# EAGLE schematic sb-mote2 (EAGLE 7.6.0)
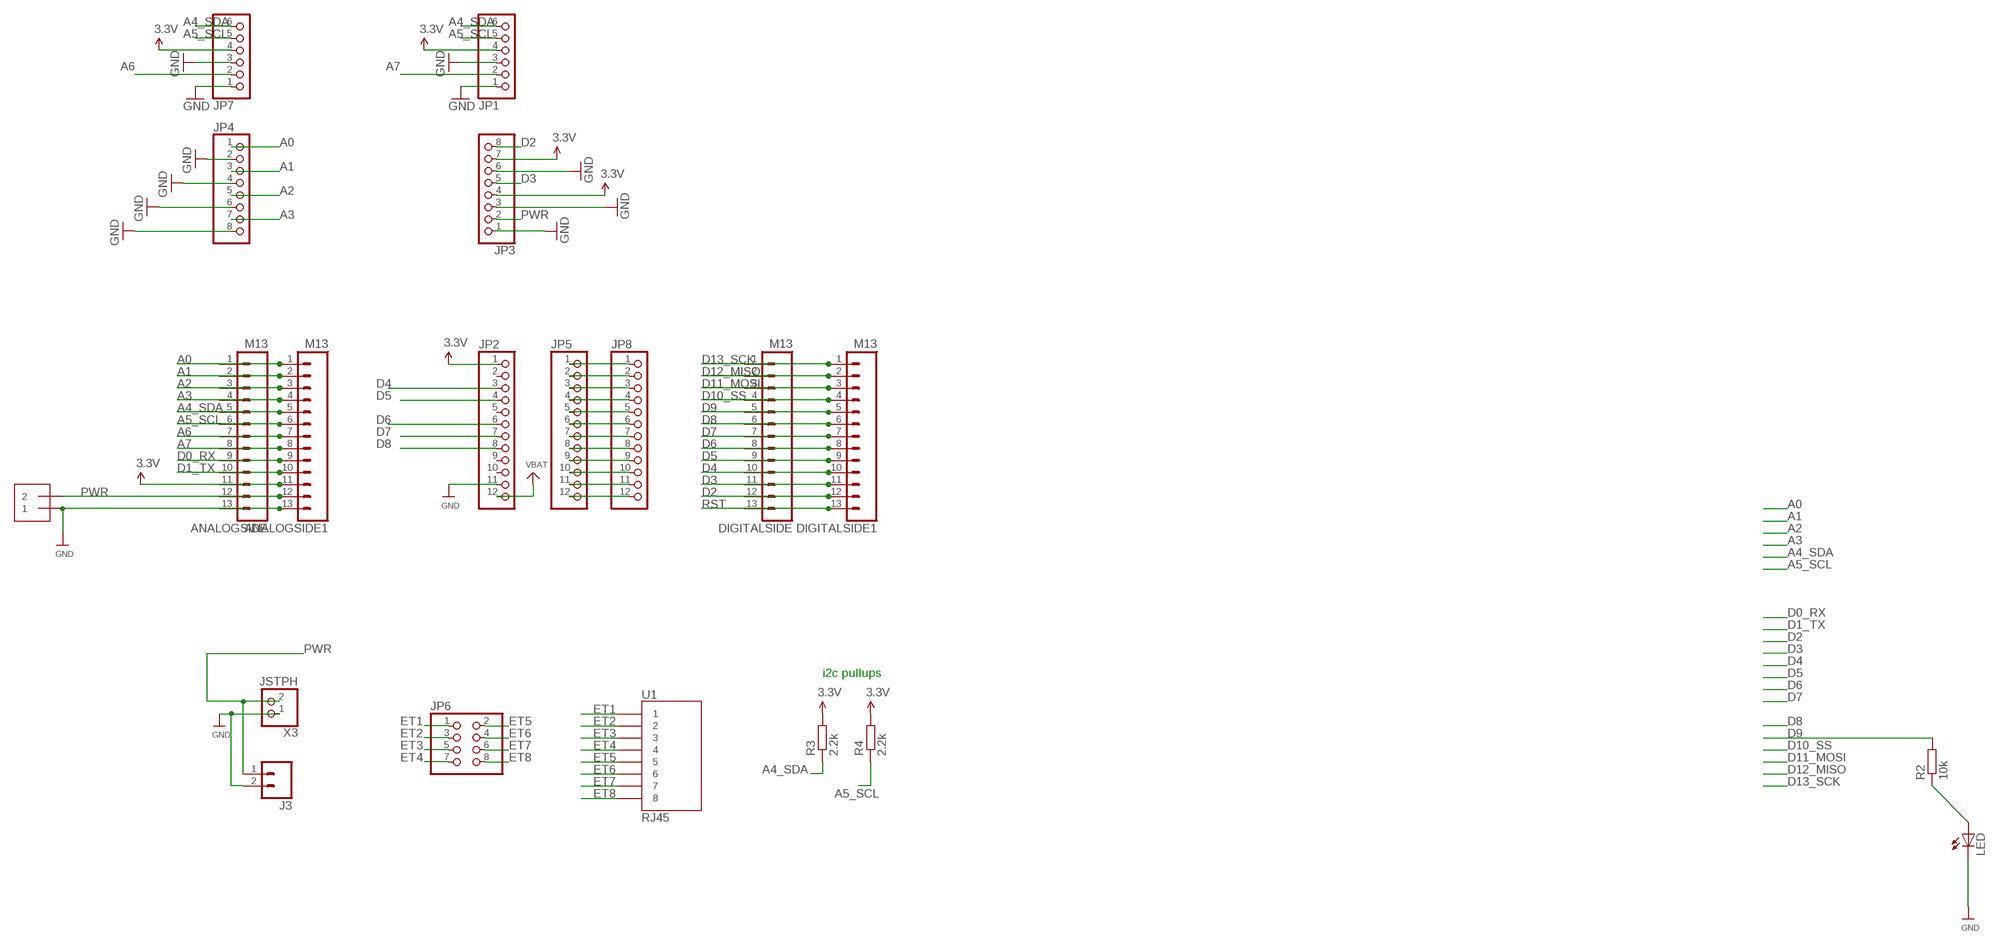
[diagram p0: schematic, sheet 1]

## Parts
ANALOGSIDE  M13  [1X13]
ANALOGSIDE1  M13  [1X13]
DIGITALSIDE  M13  [1X13]
DIGITALSIDE1  M13  [1X13]
J2  1X2-3.5MM  [1X2-3.5MM]
J3  M02PTH  [1X02]
JP1  PINHD-1X6-3.5MM  [1X06-3.5MM]
JP2  PINHD-1X12-CB  [1X12-CB]
JP3  PINHD-1X8-3.5MM  [1X08-3.5MM]
JP4  PINHD-1X8-3.5MM  [1X08-3.5MM]
JP5  PINHD-1X12-CB  [1X12-CB]
JP6  PINHD-2X4  [2X04]
JP7  PINHD-1X6-3.5MM  [1X06-3.5MM]
JP8  PINHD-1X12-CB  [1X12-CB]
LED  LED3MM  [LED3MM]
R2  10k  R-EU_0204/7  [0204/7]
R3  2.2k  R-EU_0204/7  [0204/7]
R4  2.2k  R-EU_0204/7  [0204/7]
U1  RJ45  RJ45-8PTH  [RJ45-8]
X3  JSTPH  CON_JST_PH_2PIN  [JSTPH2]

## Nets
A0: ANALOGSIDE1.1 ANALOGSIDE.1 JP4.1
A1: ANALOGSIDE1.2 ANALOGSIDE.2 JP4.3
A2: ANALOGSIDE1.3 ANALOGSIDE.3 JP4.5
A3: ANALOGSIDE1.4 ANALOGSIDE.4 JP4.7
A4_SDA: ANALOGSIDE1.5 ANALOGSIDE.5 JP1.6 JP7.6 R3.1
A5_SCL: ANALOGSIDE1.6 ANALOGSIDE.6 JP1.5 JP7.5 R4.1
A6: ANALOGSIDE1.7 ANALOGSIDE.7 JP7.2
A7: ANALOGSIDE1.8 ANALOGSIDE.8 JP1.2
D0_RX: ANALOGSIDE1.9 ANALOGSIDE.9
D1_TX: ANALOGSIDE1.10 ANALOGSIDE.10
D2: DIGITALSIDE1.12 DIGITALSIDE.12 JP3.8
D3: DIGITALSIDE1.11 DIGITALSIDE.11 JP3.5
D4: DIGITALSIDE1.10 DIGITALSIDE.10 JP2.3
D5: DIGITALSIDE1.9 DIGITALSIDE.9 JP2.4
D6: DIGITALSIDE1.8 DIGITALSIDE.8 JP2.6
D7: DIGITALSIDE1.7 DIGITALSIDE.7 JP2.7
D8: DIGITALSIDE1.6 DIGITALSIDE.6 JP2.8
D9: DIGITALSIDE1.5 DIGITALSIDE.5 R2.2
D10_SS: DIGITALSIDE1.4 DIGITALSIDE.4
D11_MOSI: DIGITALSIDE1.3 DIGITALSIDE.3
D12_MISO: DIGITALSIDE1.2 DIGITALSIDE.2
D13_SCK: DIGITALSIDE1.1 DIGITALSIDE.1
ET1: JP6.1 U1.1
ET2: JP6.3 U1.2
ET3: JP6.5 U1.3
ET4: JP6.7 U1.4
ET5: JP6.2 U1.5
ET6: JP6.4 U1.6
ET7: JP6.6 U1.7
ET8: JP6.8 U1.8
GND [power]: ANALOGSIDE1.13 ANALOGSIDE.13 J2.1 J3.2 JP1.1 JP1.3 JP2.11 JP3.1 JP3.3 JP3.6 JP4.2 JP4.4 JP4.6 JP4.8 JP7.1 JP7.3 LED.K(C) X3.1
N$1: JP5.1 JP8.1
N$2: LED.A R2.1
N$3: JP5.2 JP8.2
N$4: JP5.3 JP8.3
N$5: JP5.4 JP8.4
N$6: JP5.5 JP8.5
N$7: JP5.6 JP8.6
N$8: JP5.7 JP8.7
N$9: JP5.8 JP8.8
N$10: JP5.9 JP8.9
N$11: JP5.10 JP8.10
N$12: JP5.11 JP8.11
N$13: JP5.12 JP8.12
PWR [power]: ANALOGSIDE1.12 ANALOGSIDE.12 J2.2 J3.1 JP3.2 X3.2
RST: DIGITALSIDE1.13 DIGITALSIDE.13
SPEAKER2+: JP2.10
VBAT: JP2.12
VCC [power]: ANALOGSIDE1.11 ANALOGSIDE.11 JP1.4 JP2.1 JP3.4 JP3.7 JP7.4 R3.2 R4.2 ; supply symbol labelled 3.3V
Unconnected: JP2.2 JP2.5 JP2.9

## Notes on the sheet
- i2c pullups

## Library data of the parts
ANALOGSIDE ANALOGSIDE1 DIGITALSIDE DIGITALSIDE1 = SparkFun-Connectors:M13: 13-pin single row .1" header
J2 = adafruit:1X2: 3.5mm Terminal block http://www.ladyada.net/library/pcb/eaglelibrary.html
J3 = SparkFun-Connectors:M02: Standard 2-pin 0.1" header. Use with - straight break away headers ( PRT-00116) - right angle break away headers (PRT-00553) - swiss pins (PRT-00743) - machine pins (PRT-00117) - female headers (PRT-00115) Molex polarized connector foot print use with: PRT-08233 with associated crimp pins and housings. 2.54_SCREWTERM for use with PRT-10571. 3.5mm Screw Terminal footprints for PRT-08084 5mm Screw Terminal footprints for use with PRT-08432
JP1 JP7 = adafruit:PINHD-1X6: PIN HEADER
JP2 JP5 JP8 = adafruit2:PINHD-1X12: PIN HEADER
JP3 JP4 = adafruit:PINHD-1X8: PIN HEADER
JP6 = pinhead:PINHD-2X4: PIN HEADER
LED = led:LED: LED OSRAM: - CHIPLED LG R971, LG N971, LY N971, LG Q971, LY Q971, LO R971, LY R971 LH N974, LH R974 LS Q976, LO Q976, LY Q976 LO Q996 - Hyper CHIPLED LW Q18S LB Q993, LB Q99A, LB R99A - SideLED LS A670, LO A670, LY A670, LG A670, LP A670 LB A673, LV A673, LT A673, LW A673 LH A674 LY A675 LS A676, LA A676, LO A676, LY A676, LW A676 LS A679, LY A679, LG A679 - Hyper Micro SIDELED® LS Y876, LA Y876, LO Y876, LY Y876 LT Y87S - SmartLED LW L88C, LW L88S LB L89C, LB L89S, LG L890 LS L89K, LO L89K, LY L89K LS L896, LA L896, LO L896, LY L896 - TOPLED LS T670, LO T670, LY T670, LG T670, LP T670 LSG T670, LSP T670, LSY T670, LOP T670, LYG T670 LG T671, LOG T671, LSG T671 LB T673, LV T673, LT T673, LW T673 LH T674 LS T676, LA T676, LO T676, LY T676, LB T676, LH T676, LSB T676, LW T676 LB T67C, LV T67C, LT T67C, LS T67K, LO T67K, LY T67K, LW E67C LS E67B, LA E67B, LO E67B, LY E67B, LB E67C, LV E67C, LT E67C LW T67C LS T679, LY T679, LG T679 LS T770, LO T770, LY T770, LG T770, LP T770 LB T773, LV T773, LT T773, LW T773 LH T774 LS E675, LA E675, LY E675, LS T675 LS T776, LA T776, LO T776, LY T776, LB T776 LHGB T686 LT T68C, LB T68C - Hyper Mini TOPLED® LB M676 - Mini TOPLED Santana® LG M470 LS M47K, LO M47K, LY M47K Source: http://www.osram.convergy.de LUXEON: - LUMILED® LXK2-PW12-R00, LXK2-PW12-S00, LXK2-PW14-U00, LXK2-PW14-V00 LXK2-PM12-R00, LXK2-PM12-S00, LXK2-PM14-U00 LXK2-PE12-Q00, LXK2-PE12-R00, LXK2-PE12-S00, LXK2-PE14-T00, LXK2-PE14-U00 LXK2-PB12-K00, LXK2-PB12-L00, LXK2-PB12-M00, LXK2-PB14-N00, LXK2-PB14-P00, LXK2-PB14-Q00 LXK2-PR12-L00, LXK2-PR12-M00, LXK2-PR14-Q00, LXK2-PR14-R00 LXK2-PD12-Q00, LXK2-PD12-R00, LXK2-PD12-S00 LXK2-PH12-R00, LXK2-PH12-S00 LXK2-PL12-P00, LXK2-PL12-Q00, LXK2-PL12-R00 Source: www.luxeon.com KINGBRIGHT: KA-3528ASYC Source: www.kingbright.com
R2-R4 = resistor:R-EU_: RESISTOR, European symbol
U1 = SparkFun:RJ45-8: RJ45 Jack Simple RJ45, 8-pin connection - connector for common Cat5, Cat5e, and Cat6 Ethernet cables. Footprint not yet proven in production. Connector sku is PRT-00643; Breakout PCB sku is BOB-00716.
X3 = microbuilder:CON_JST_PH_2PIN: JST 2-Pin Right-Angle Connector PH-Series - 4UConnector: 17311 SH-Series - 4UConnector: 07278

## Net classes
1 power: width 0.381 mm, clearance 0.254 mm